# Altium schematic sheet xSignals(1).SchDoc: Using xSignals in a High-Speed Design
size 431 x 279 mm; Organization: ORGANIZATION; Address1: ADDRESS 1; Address2: ADDRESS 2; Address3: ADDRESS 3; Address4: ADDRESS 4; Revision: -; ENG_APP_DATE: --/--/--; DSN_APP_DATE: --/--/--; CHK_APP_DATE: --/--/--
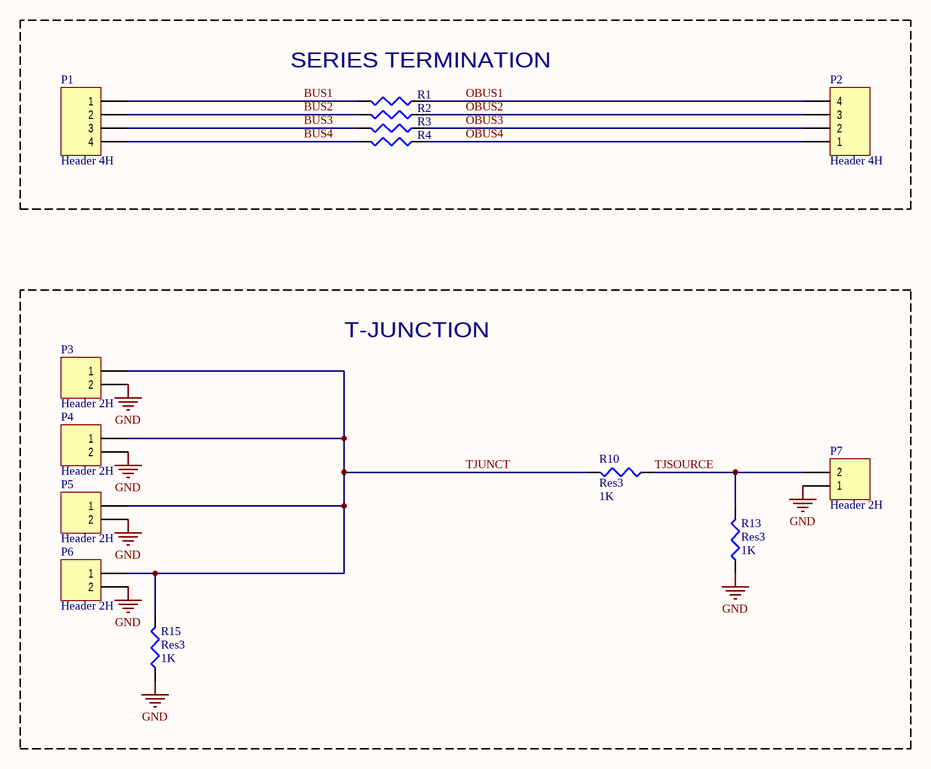
[diagram p0: xSignals(1).SchDoc]

## Parts
P1  Header 4H  [HDR1X4H]
P2  Header 4H  [HDR1X4H]
P3  Header 2H  [HDR1X2H]
P4  Header 2H  [HDR1X2H]
P5  Header 2H  [HDR1X2H]
P6  Header 2H  [HDR1X2H]
P7  Header 2H  [HDR1X2H]
R1  Res3  [J1-0603]  (value not drawn)
R2  Res3  [J1-0603]  (value not drawn)
R3  Res3  [J1-0603]  (value not drawn)
R4  Res3  [J1-0603]  (value not drawn)
R10  Res3  value 1K  [J1-0603]
R13  Res3  value 1K  [J1-0603]
R15  Res3  value 1K  [J1-0603]

## Blocks framed on the sheet
SERIES TERMINATION: P1 P2 R1-R4
T-JUNCTION: P3-P7 R10 R13 R15

## Nets
GND: P3.2 P4.2 P5.2 P6.2 P7.1 R13.1 R15.1
BUS1: P1.1 R1.2
BUS2: P1.2 R2.2
BUS3: P1.3 R3.2
BUS4: P1.4 R4.2
OBUS1: P2.4 R1.1
OBUS2: P2.3 R2.1
OBUS3: P2.2 R3.1
OBUS4: P2.1 R4.1
TJSOURCE: P7.2 R10.1 R13.2
TJUNCT: P3.1 P4.1 P5.1 P6.1 R10.2 R15.2

## Notes on the sheet
- 8
- 7
- 6
- 5
- 4
- 3
- DWG. NO.
- REV.
- SHT.
- 2
- 1
- THIS DOCUMENT AND THE DATA DISCLOSED HEREIN OR HEREWITH IS THE PROPERTY OF ALTIUM LIMITED AND MAY BE FREELY DISTRIBUTED IN WHOLE. NO RIGHTS ARE RESERVED OR EXPRESS OR IMPLIED WARANTEE GIVEN.
- REVISION
- DESCRIPTION
- DATE
- APPROVED
- F
- E
- D
- C
- B
- ENG:
- APPROVALS
- PROJECT
- A
- DSN:
- CHK:
- REFERENCE DOCUMENTS
- PROJECT REVISION:
- TITLE
- DOCUMENT REVISION:
- DESIGN ITEM:
- BOM:
- FAB DWG:
- PCB DWG:
- ASSY DWG:
- SCALE:
- SIZE
- CAGE CODE
- FILE NAME
- DWG NO.
- SHEET
- OF
- REV

## Library data of the parts
P1 P2 = Header 4H: Header, 4-Pin, Right Angle; LatestRevisionDate: 17-Jul-2002; LatestRevisionNote: Re-released for DXP Platform.; Publisher: Altium Limited
P3-P7 = Header 2H: Header, 2-Pin, Right Angle; LatestRevisionDate: 17-Jul-2002; LatestRevisionNote: Re-released for DXP Platform.; Publisher: Altium Limited
R1-R4 = Res3: Resistor; Value: 1K; Published: 8-Jun-2000; LatestRevisionDate: 29-May-2009; LatestRevisionNote: IPC-7351 Footprint Added.; PackageReference: J1-0603; Publisher: Altium Limited; PackageDescription: Chip Resistor
R10 R13 R15 = Res3: Resistor; Published: 8-Jun-2000; LatestRevisionDate: 29-May-2009; LatestRevisionNote: IPC-7351 Footprint Added.; PackageReference: J1-0603; Publisher: Altium Limited; PackageDescription: Chip Resistor